# Altium schematic sheet Display.SchDoc
size A4
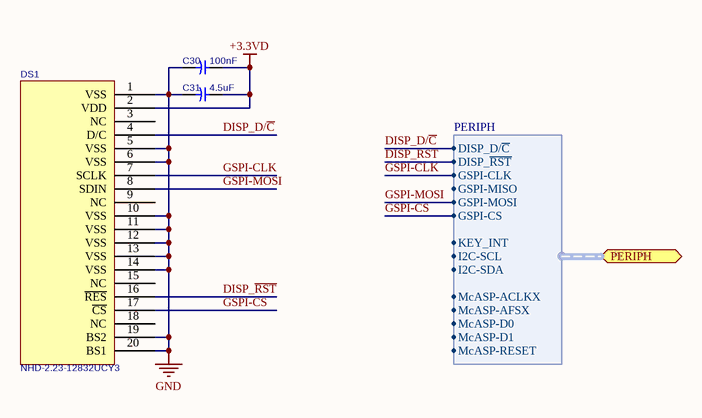
[diagram p0: Display.SchDoc]

## Parts
C30  100nF  [C_0603A]
C31  4.5uF  [C_0603A]
DS1  NHD-2.23-12832UCY3  [NHD-2.23-12832UCY3_FP]

## Ports
PERIPH (harness PERIPH)

## Harnesses
PERIPH: DISP_D/~{C}, DISP_~{RST}, GSPI-CLK, GSPI-MISO, GSPI-MOSI, GSPI-CS, KEY_INT, I2C-SCL, I2C-SDA, McASP-ACLKX, McASP-AFSX, McASP-D0, McASP-D1, McASP-RESET

## Nets
+3.3VD: C30.1 C31.1 DS1.2(VDD)
GND: C30.2 C31.2 DS1.1(VSS) DS1.5(VSS) DS1.6(VSS) DS1.10(VSS) DS1.11(VSS) DS1.12(VSS) DS1.13(VSS) DS1.14(VSS) DS1.19(BS2) DS1.20(BS1)
DISP_D/~{C}: DS1.4(D/C) ; port PERIPH.DISP_D/~{C}
DISP_~{RST}: DS1.16(~{RES}) ; port PERIPH.DISP_~{RST}
GSPI-CLK: DS1.7(SCLK) ; port PERIPH.GSPI-CLK
GSPI-CS: DS1.17(~{CS}) ; port PERIPH.GSPI-CS
GSPI-MOSI: DS1.8(SDIN) ; port PERIPH.GSPI-MOSI

Not connected (* = marked no-connect by the designer): DS1 3(NC) 9(NC) 15(NC) 18(NC)

## Library data of the parts
C30 C31 = C_0603: PackageReference: C_0603
  C30: VALUE: 100nF
  C31: VALUE: 4.5uF
DS1 = NHD-2.23-12832UCY3: OLED DISPLAY; Manufacturer: Newhaven Display Intl; Background Color: Black; Graphics Color: Yellow; Dot Size: 0.41mm W x 0.39mm H; Diagonal Screen Size: 2.23" (56.64mm); Display Type: OLED - Passive Matrix; Viewing Area: 60.00mm W x 18.00mm H; Backlight: Without Backlight; Dot Pixels: 128 x 32; Interface: I²C, Parallel 8-Bit, SPI; Dot Pitch: 0.43mm W x 0.41mm H; Part Status: Active; Supplier 1: Digi-Key; Display Mode: -; Category: Optoelectronics; Manufacturer Part Number: NHD-2.23-12832UCY3; Touchscreen: -; RoHS: RoHS Compliant; ComponentLink1URL: http://www.newhavendisplay.com/specs/NHD-2.23-12832UCY3.pdf; ComponentLink1Description: http://www.newhavendisplay.com/specs/NHD-2.23-12832UCY3.pdf; Supplier Part Number 1: NHD-2.23-12832UCY3-ND